# EAGLE design N2a (EAGLE 6.6.0)
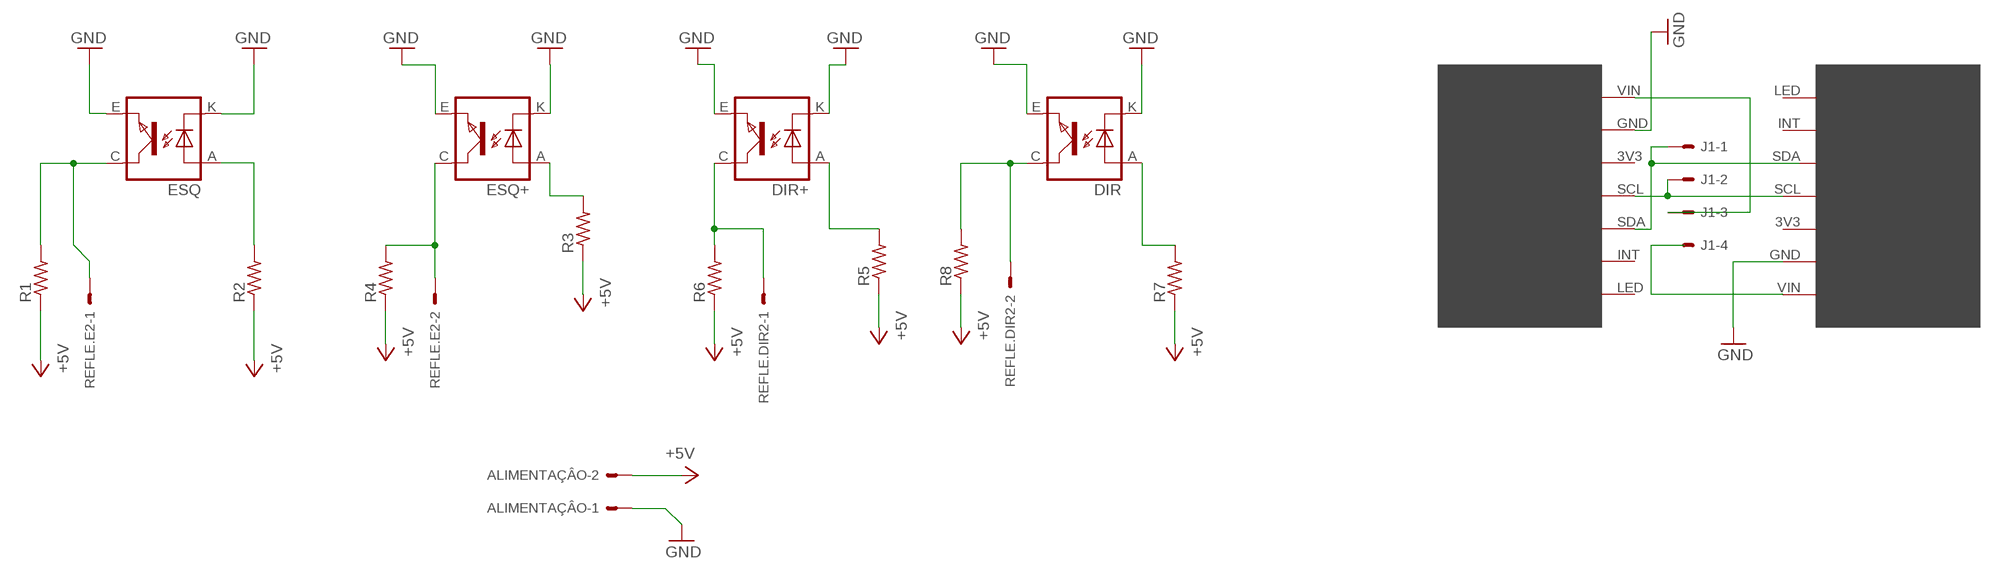
[diagram p0: schematic, sheet 1]

## Parts
ALIMENTAÇÂO  CONN_0205-7028  [7395-02]
DIR  TCRT5000  [TCRT5000]
DIR+  TCRT5000  [TCRT5000]
ESQ  TCRT5000  [TCRT5000]
ESQ+  TCRT5000  [TCRT5000]
J1  CONN_0405-7048  [7395-04]
R1  R-US_0204/7  [0204/7]
R2  R-US_0204/7  [0204/7]
R3  R-US_0204/7  [0204/7]
R4  R-US_0204/7  [0204/7]
R5  R-US_0204/7  [0204/7]
R6  R-US_0204/7  [0204/7]
R7  R-US_0204/7  [0204/7]
R8  R-US_0204/7  [0204/7]
REFLE.DIR2  CONN_0205-7028  [7395-02]
REFLE.E2  CONN_0205-7028  [7395-02]
TCS1  TCS34725  [TCS34725]
TCS2  TCS34725  [TCS34725]

## Nets
+5V: ALIMENTAÇÂO.2 R1.1 R2.1 R3.1 R4.1 R5.1 R6.1 R7.1 R8.1
GND: ALIMENTAÇÂO.1 DIR+.E(EMITTER) DIR+.K(CATHODE) DIR.E(EMITTER) DIR.K(CATHODE) ESQ+.E(EMITTER) ESQ+.K(CATHODE) ESQ.E(EMITTER) ESQ.K(CATHODE) TCS1.GND TCS2.GND
N$1: ESQ+.C(COLLECTOR) R4.2 REFLE.E2.2
N$2: ESQ.C(COLLECTOR) R1.2 REFLE.E2.1
N$3: ESQ+.A(ANODE) R3.2
N$4: DIR+.A(ANODE) R5.2
N$5: DIR+.C(COLLECTOR) R6.2 REFLE.DIR2.1
N$6: DIR.A(ANODE) R7.2
N$7: DIR.C(COLLECTOR) R8.2 REFLE.DIR2.2
N$8: J1.1 TCS1.SDA
N$9: ESQ.A(ANODE) R2.2
N$10: J1.2 TCS1.SCL TCS2.SCL
N$11: TCS2.VIN
N$12: J1.3 TCS1.VIN
Unconnected: J1.4 TCS1.3V3 TCS1.INT TCS1.LED TCS2.3V3 TCS2.INT TCS2.LED TCS2.SDA

## Library data of the parts
ALIMENTAÇÂO REFLE.DIR2 REFLE.E2 = Robotica-IFRN-SC-conectores:CONN_02: CONNECTOR wire to board 2.54 mm (.1 inch) pitch header; OC_FARNELL: 9731601; OC_NEWARK: unknown
DIR DIR+ ESQ ESQ+ = Robotica-IFRN-SC-sensores:TCRT5000
J1 = Robotica-IFRN-SC-conectores:CONN_04: CONNECTOR wire to board 2.54 mm (.1 inch) pitch header; OC_FARNELL: unknown; OC_NEWARK: unknown
R1-R8 = rcl:R-US_: RESISTOR, American symbol; SPICEPREFIX: R
TCS1 TCS2 = Robotica-IFRN-SC-sensores:TCS34725: Sensor de cor TCS34725

## Board
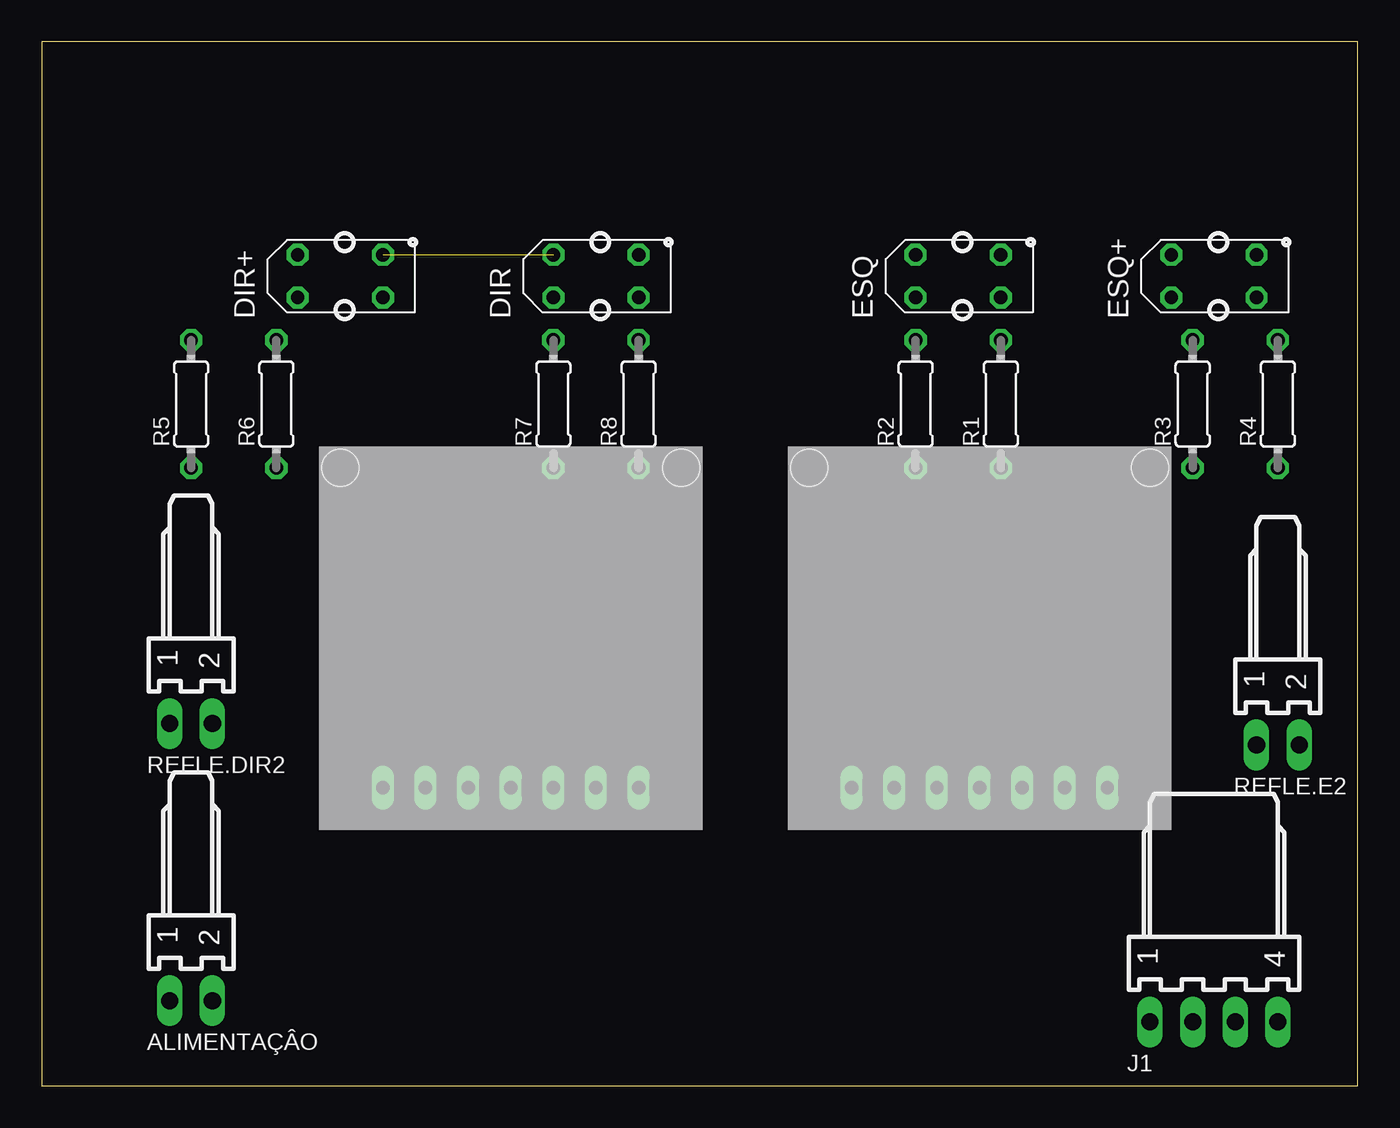
[diagram p1: board, top side]
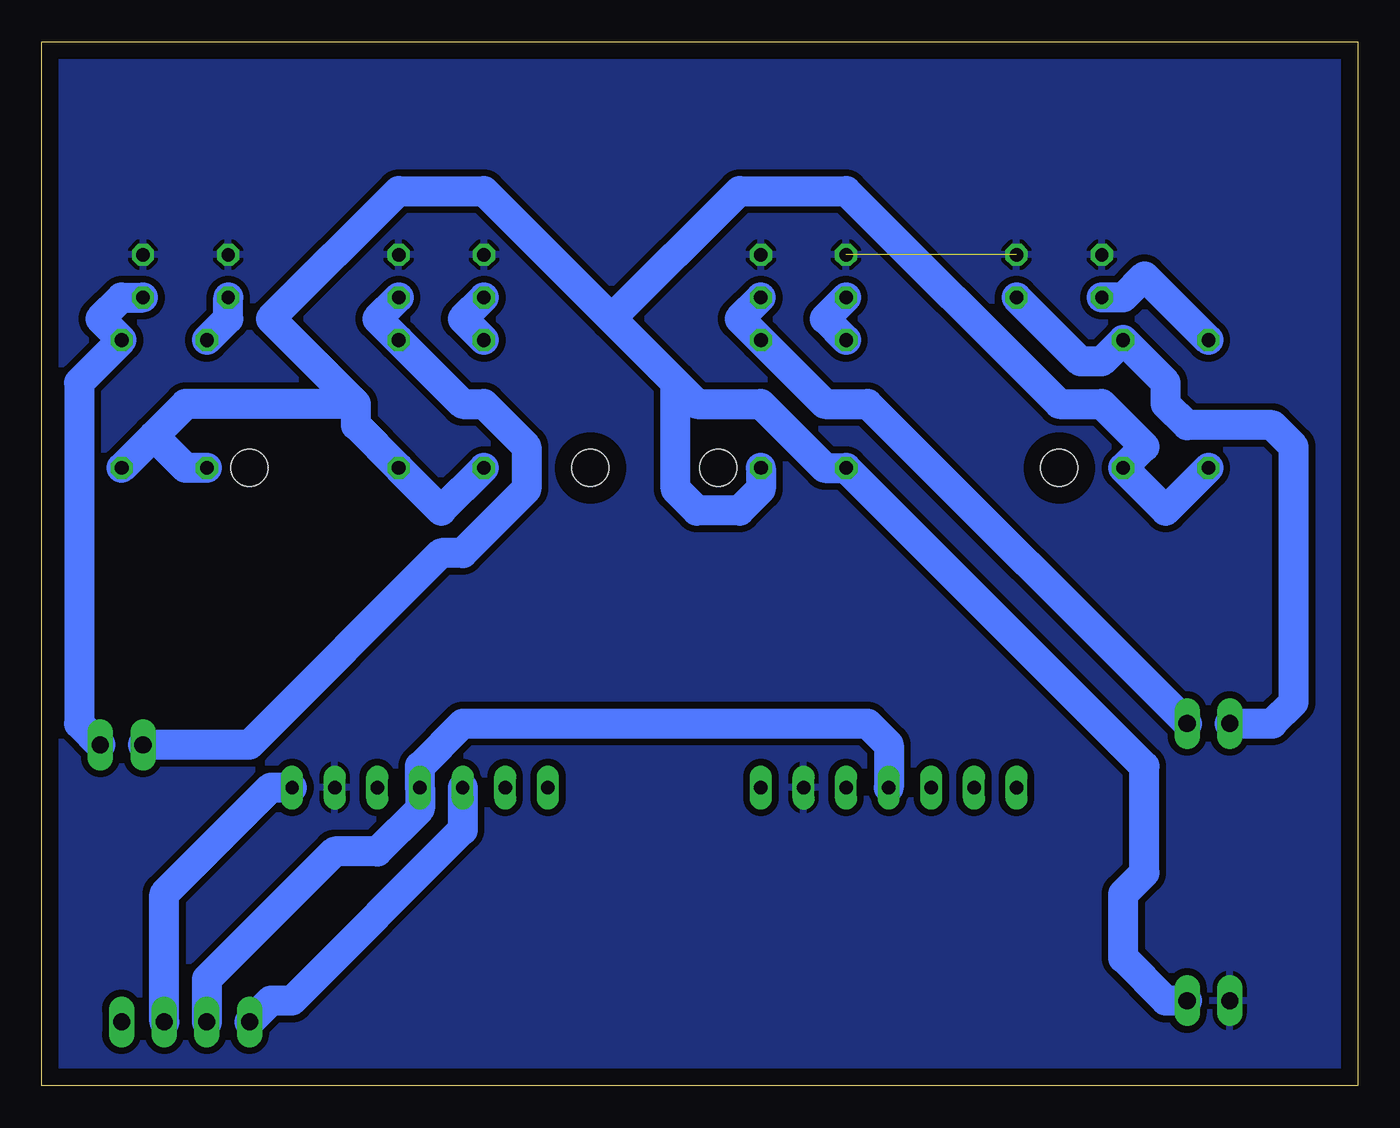
[diagram p2: board, bottom side, seen from below]

Size 78.41 x 62.22 mm. Coordinates in mm from the lower left corner, seen from the top.
Outline: 0,0 78.41,0 78.41,62.22 0,62.22 0,0
Copper layers (1*16): Top 0.035mm / dielectric 1.5mm / Bottom 0.035mm
Design rules "default *": minimum track width 70mil, minimum drill 24mil, track to track 16mil, track to pad 16mil, pad to pad 16mil, via to via 16mil, smd to smd 8mil, copper to edge 40mil, drill to drill 8mil, minimum pad ring 10mil, minimum via ring 8mil, stop-mask expansion 4mil, vias tented up to drill 0mil, thermal gap 10mil

### Footprints (pad centres in the part's own frame; a part is rotated, then mirrored left to right if it is on the bottom)
7395-02 = drill 1.016 long: 1 1.27,0; 2 -1.27,0
TCRT5000 = drill 0.8 octagon: A -2.54,-1.27; C 2.54,-1.27; E 2.54,1.27; K -2.54,1.27
7395-04 = drill 1.016 long: 1 3.81,0; 2 1.27,0; 3 -1.27,0; 4 -3.81,0
0204/7 = drill 0.813 octagon: 1 -3.81,0; 2 3.81,0
TCS34725 = drill 0.8 long: 3V3 0,-5.08; GND 2.54,-5.08; INT -7.62,-5.08; LED -10.16,-5.08; SCL -2.54,-5.08; SDA -5.08,-5.08; VIN 5.08,-5.08 | hole 2.2: -12.7,13.97; 7.62,13.97

### Placement (x,y rotation side)
ALIMENTAÇÂO  8.89,5.08 180 top
DIR  33.02,48.26 0 top
DIR+  17.78,48.26 0 top
ESQ  54.61,48.26 0 top
ESQ+  69.85,48.26 0 top
J1  69.85,3.81 180 top
R1  57.15,40.64 90 top
R2  52.07,40.64 90 top
R3  68.58,40.64 90 top
R4  73.66,40.64 90 top
R5  8.89,40.64 90 top
R6  13.97,40.64 90 top
R7  30.48,40.64 90 top
R8  35.56,40.64 90 top
REFLE.DIR2  8.89,21.59 180 top
REFLE.E2  73.66,20.32 180 top
TCS1  58.42,22.86 0 top
TCS2  30.48,22.86 0 top

### Tracks (layer width: path | path; a pad name or v marks a point on that pad's centre or on a via)
+5V
  Bottom 1.778: R5.1 11.43,34.29 R6.1 12.7,38.1 15.24,40.64 17.78,40.64 30.48,53.34 36.83,53.34 44.45,45.72 | 44.45,45.72 52.07,53.34 57.15,53.34 64.77,45.72 59.69,40.64 | 44.45,45.72 40.64,41.91 | 40.64,41.91 39.37,40.64 35.56,40.64 31.75,36.83 R7.1 12.7,19.05 12.7,12.7 13.97,11.43 13.97,7.62 11.43,5.08 ALIMENTAÇÂO.2 | 59.69,40.64 59.69,39.37 R1.1 54.61,34.29 R2.1 | 71.76,38.73 69.85,40.64 59.69,40.64 | 71.76,38.73 R4.1 | R3.1 69.85,36.83 71.76,38.73 | R8.1 35.56,35.56 36.83,34.29 39.37,34.29 40.64,35.56 40.64,41.91
GND  (1 unrouted)
  pour Bottom: 0,0 0,62.23 78.74,62.23 78.74,0
N$1
  Bottom 1.778: ESQ+.C 73.66,46.99 74.93,45.72 R4.2 76.2,41.91 76.2,21.59 REFLE.E2.2
N$2
  Bottom 1.778: ESQ.C 58.42,45.72 R1.2 53.34,40.64 52.07,40.64 49.53,38.1 49.53,35.56 53.34,31.75 54.61,31.75 66.04,20.32 REFLE.E2.1
N$3
  Bottom 1.778: ESQ+.A 67.31,45.72 R3.2
N$4
  Bottom 1.778: DIR+.A 13.97,46.99 12.7,48.26 R5.2
N$5
  Bottom 1.778: DIR+.C 16.51,43.18 15.24,43.18 R6.2 11.43,41.91 11.43,40.64 10.16,39.37 5.08,39.37 3.81,38.1 3.81,22.86 5.08,21.59 REFLE.DIR2.1
N$6
  Bottom 1.778: DIR.A 31.75,45.72 R7.2
N$7
  Bottom 1.778: DIR.C 36.83,45.72 R8.2 31.75,40.64 29.21,40.64 REFLE.DIR2.2
N$8
  Bottom 1.778: TCS1.SDA 53.34,15.24 63.5,5.08 64.77,5.08 J1.1
N$9
  Bottom 1.778: ESQ.A 53.34,45.72 R2.2
N$10
  Bottom 1.778: TCS2.SCL 27.94,20.32 29.21,21.59 53.34,21.59 55.88,19.05 TCS1.SCL 55.88,16.51 58.42,13.97 60.96,13.97 68.58,6.35 J1.2
N$12
  Bottom 1.778: J1.3 71.12,11.43 64.77,17.78 TCS1.VIN